# EAGLE design clock2_v1 (EAGLE 9.6.2)
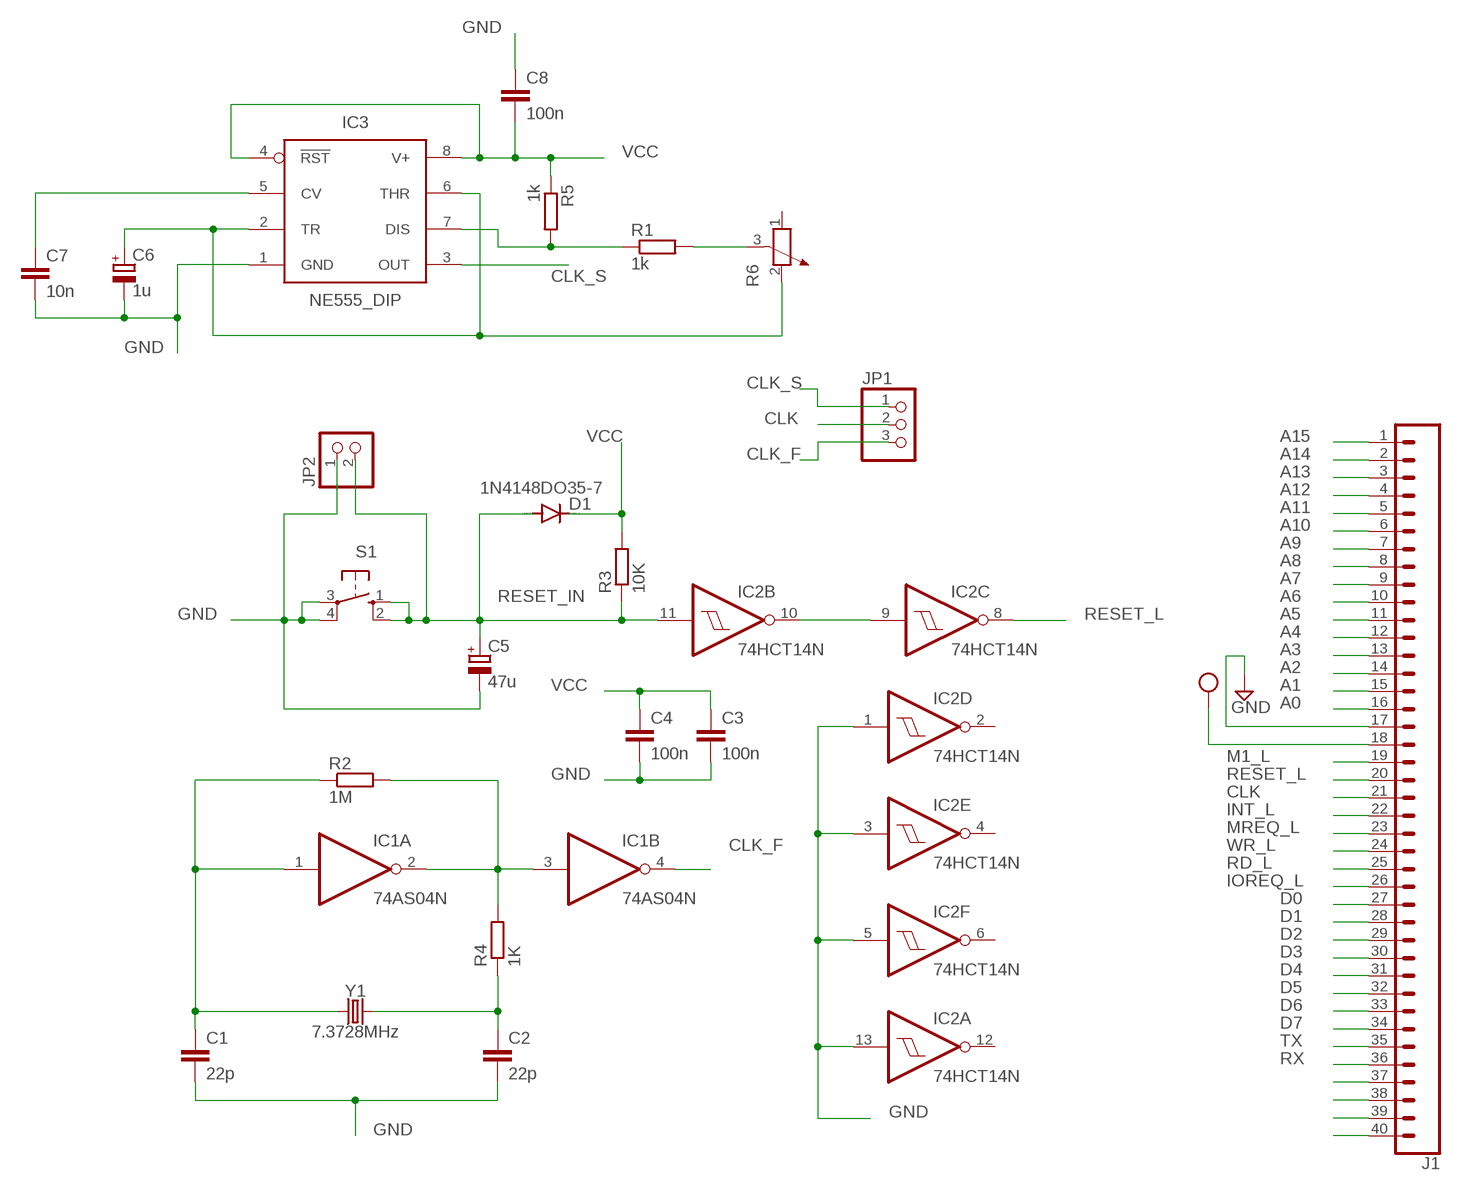
[diagram p0: schematic, sheet 1]

## Parts
C1  22p  C-EU025-024X044  [C025-024X044]
C2  22p  C-EU025-024X044  [C025-024X044]
C3  100n  C-EU025-024X044  [C025-024X044]
C4  100n  C-EU025-024X044  [C025-024X044]
C5  47u  CPOL-EUE2.5-5  [E2,5-5]
C6  1u  CPOL-EUE2.5-5  [E2,5-5]
C7  10n  C-EU050-025X075  [C050-025X075]
C8  100n  C-EU050-025X075  [C050-025X075]
D1  1N4148DO35-7  [DO35-7]
IC1  74AS04N  [DIL14]
IC2  74HCT14N  [DIL14]
IC3  NE555_DIP  [DIP826W53P254L959H508Q8B]
J1  CONN_40OFFSET  [1X40_OFFSET]
JP1  PINHD-1X3  [1X03]
JP2  PINHD-1X2  [1X02]
R1  1k  R-EU_0207/7  [0207/7]
R2  1M  R-EU_0204/5  [0204/5]
R3  10K  R-EU_0207/7  [0207/7]
R4  1K  R-EU_0204/5  [0204/5]
R5  1k  R-EU_0207/7  [0207/7]
R6  POTENTIOMETER_PT-10S  [PT-10S]
S1  10-XX  [B3F-10XX]
Y1  7.3728MHz  CRYSTALPTH-HC49UV  [HC49U]

## Nets
A0: J1.16
A1: J1.15
A2: J1.14
A3: J1.13
A4: J1.12
A5: J1.11
A6: J1.10
A7: J1.9
A8: J1.8
A9: J1.7
A10: J1.6
A11: J1.5
A12: J1.4
A13: J1.3
A14: J1.2
A15: J1.1
CLK: J1.21 JP1.2
CLK_F: IC1.4(B:O) JP1.3
CLK_S: IC3.3(OUT) JP1.1
D0: J1.27
D1: J1.28
D2: J1.29
D3: J1.30
D4: J1.31
D5: J1.32
D6: J1.33
D7: J1.34
GND: C1.2 C2.2 C3.2 C4.2 C5.- C6.- C7.2 C8.1 IC2.1(D:I) IC2.3(E:I) IC2.5(F:I) IC2.13(A:I) IC3.1(GND) J1.17 JP2.1 S1.3(P) S1.4(P1)
INT_L: J1.22
IOREQ_L: J1.26
M1_L: J1.19
MREQ_L: J1.23
N$1: C1.1 IC1.1(A:I) R2.1 Y1.1
N$2: C2.1 R4.1 Y1.2
N$3: C7.1 IC3.5(CV)
N$4: IC1.2(A:O) IC1.3(B:I) R2.2 R4.2
N$5: IC2.9(C:I) IC2.10(B:O)
N$6: J1.37
N$7: J1.38
N$8: J1.39
N$9: C6.+ IC3.2(TR) IC3.6(THR) R6.2
N$10: IC3.7(DIS) R1.1 R5.2
N$12: R1.2 R6.3
N$13: J1.40
RD_L: J1.25
RESET_IN: C5.+ D1.A IC2.11(B:I) JP2.2 R3.1 S1.1(S) S1.2(S1)
RESET_L: IC2.8(C:O) J1.20
RX: J1.36
TX: J1.35
VCC: C3.1 C4.1 C8.2 D1.C IC3.4(!RST) IC3.8(V+) J1.18 R3.2 R5.1
WR_L: J1.24
Unconnected: IC1.5(C:I) IC1.6(C:O) IC1.8(D:O) IC1.9(D:I) IC1.10(E:O) IC1.11(E:I) IC1.12(F:O) IC1.13(F:I) IC2.2(D:O) IC2.4(E:O) IC2.6(F:O) IC2.12(A:O) R6.1

## Power pins joined to a net without a drawn wire
GND: IC1.7(P:GND) IC2.7(P:GND)
VCC: IC1.14(P:VCC) IC2.14(P:VCC)

## Library data of the parts
C1-C4 C7 C8 = rcl:C-EU: CAPACITOR, European symbol; SPICEPREFIX: C
C5 C6 = rcl:CPOL-EU: POLARIZED CAPACITOR, European symbol; SPICEPREFIX: C
D1 = diode:1N4148: DIODE high speed (Philips)
IC1 = 74xx-eu:74*04: Hex INVERTER
IC2 = 74xx-eu:74*14: Hex schmitt trigger INVERTER
IC3 = IC_Clock-Timing:*555: TIMER 555 General purpose precision timers NE555 : Texas Datasheet <http://www.ti.com/general/docs/suppproductinfo.tsp?distId=10&gotoUrl=http%3A%2F%2Fwww.ti.com%2Flit%2Fgpn%2Fne555>, Diodes Incorporated Datasheet <https://www.diodes.com/assets/Datasheets/NE555_SA555_NA555.pdf> LM555 Datasheet <http://www.ti.com/general/docs/suppproductinfo.tsp?distId=10&gotoUrl=http%3A%2F%2Fwww.ti.com%2Flit%2Fgpn%2Flm555> LMC555 Datasheet <http://www.ti.com/general/docs/suppproductinfo.tsp?distId=10&gotoUrl=http%3A%2F%2Fwww.ti.com%2Flit%2Fgpn%2Flmc555> ICM7555 : Maxim Integrated Datasheet <https://datasheets.maximintegrated.com/en/ds/ICM7555-ICM7556.pdf>, Renesas Electronics America Inc Datasheet <https://www.renesas.com/en-us/www/doc/datasheet/icm7555-56.pdf>; CATEGORY: IC_Clock-Timing; CURRENT-SUPPLY: 10mA; DESCRIPTION: IC OSC SINGLE TIMER 100KHZ 8-DIP; FREQUENCY: 100kHz; MANUFACTURER: Texas Instruments; MPN: NE555P; OPERATING_TEMP: 0°C to 70°C; PART_STATUS: Active; ROHS_COMPLIANT: ROHS3 Compliant; SUB-CATEGORY: Timer
J1 = SparkFun-Connectors:CONN_40: Multi connection point. Often used as Generic Header-pin footprint for 0.1 inch spaced/style header connections On any of the 0.1 inch spaced packages, you can populate with these: Break Away Headers - Straight <https://www.sparkfun.com/products/116> (PRT-00116) Break Away Male Headers - Right Angle <https://www.sparkfun.com/products/553> (PRT-00553) Female Headers <https://www.sparkfun.com/products/115> (PRT-00115) Break Away Headers - Machine Pin <https://www.sparkfun.com/products/117> (PRT-00117) Break Away Female Headers - Swiss Machine Pin <https://www.sparkfun.com/products/743> (PRT-00743) For SCREWTERMINALS and SPRING TERMINALS visit here: Screw Terimnals on SparkFun.com <https://www.sparkfun.com/search/results?term=Screw+Terminals> (5mm/3.5mm/2.54mm spacing) This device is also useful as a general connection point to wire up your design to another part of your project. Our various solder wires solder well into these plated through hole pads. Hook-Up Wire - Assortment (Stranded, 22 AWG) <https://www.sparkfun.com/products/11375> (PRT-11375) Hook-Up Wire - Assortment (Solid Core, 22 AWG) <https://www.sparkfun.com/products/11367> (PRT-11367) View the entire wire category on our website here <https://www.sparkfun.com/categories/141> Special notes: Molex polarized connector foot print use with SKU : PRT-08231 with associated crimp pins and housings. 1MM SMD Version SKU: PRT-10208 NOTES ON THE VARIANTS LOCK and LOCK_LONGPADS... This footprint was designed to help hold the alignment of a through-hole component (i.e. 6-pin header) while soldering it into place. You may notice that each hole has been shifted either up or down by 0.005 of an inch from it's more standard position (which is a perfectly straight line). This slight alteration caused the pins (the squares in the middle) to touch the edges of the holes. Because they are alternating, it causes a "brace" to hold the component in place. 0.005 has proven to be the perfect amount of "off-center" position when using our standard breakaway headers. Although looks a little odd when you look at the bare footprint, once you have a header in there, the alteration is very hard to notice. Also,if you push a header all the way into place, it is covered up entirely on the bottom side.
JP1 = pinhead:PINHD-1X3: PIN HEADER
JP2 = pinhead:PINHD-1X2: PIN HEADER
R1-R5 = rcl:R-EU_: RESISTOR, European symbol; SPICEPREFIX: R
R6 = rcl:POTENTIOMETER_: Potentiometer; SPICEMODEL: POT; SPICEPREFIX: X
S1 = switch-omron:10-XX: OMRON SWITCH; MPN: B3F-1000; OC_FARNELL: 176432; OC_NEWARK: 36M3542
Y1 = SparkFun-Clocks:CRYSTAL: Crystals (Generic) These are passive quartz crystals, which can be used as a clock source for a microcontroller. Crystal's are two-terminal devices. They require external "load" capacitors to generate an oscillating signal.

## Board
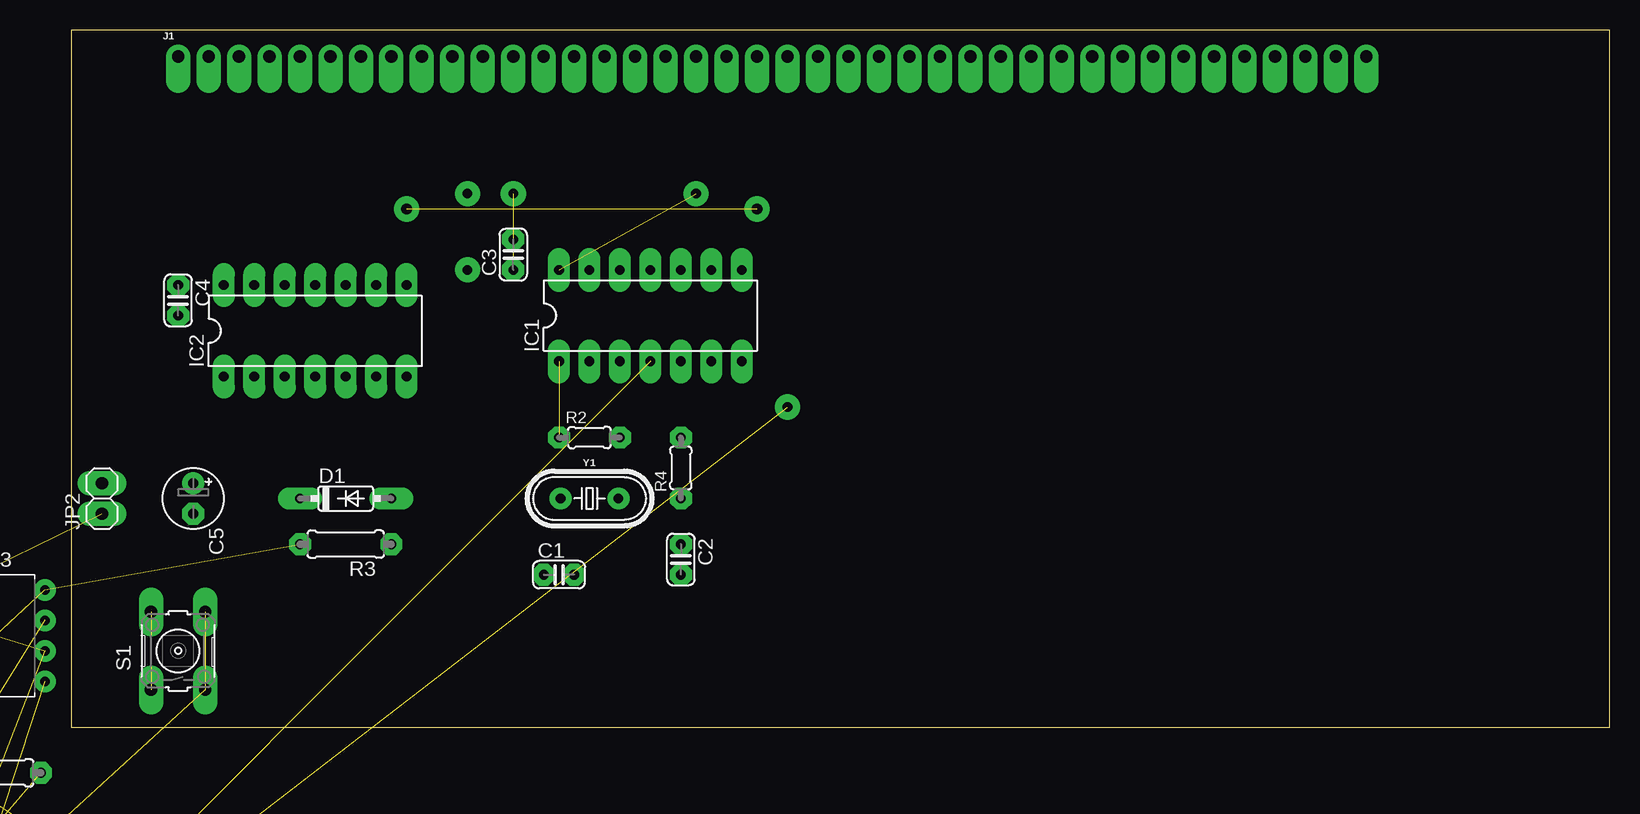
[diagram p1: board, top side]
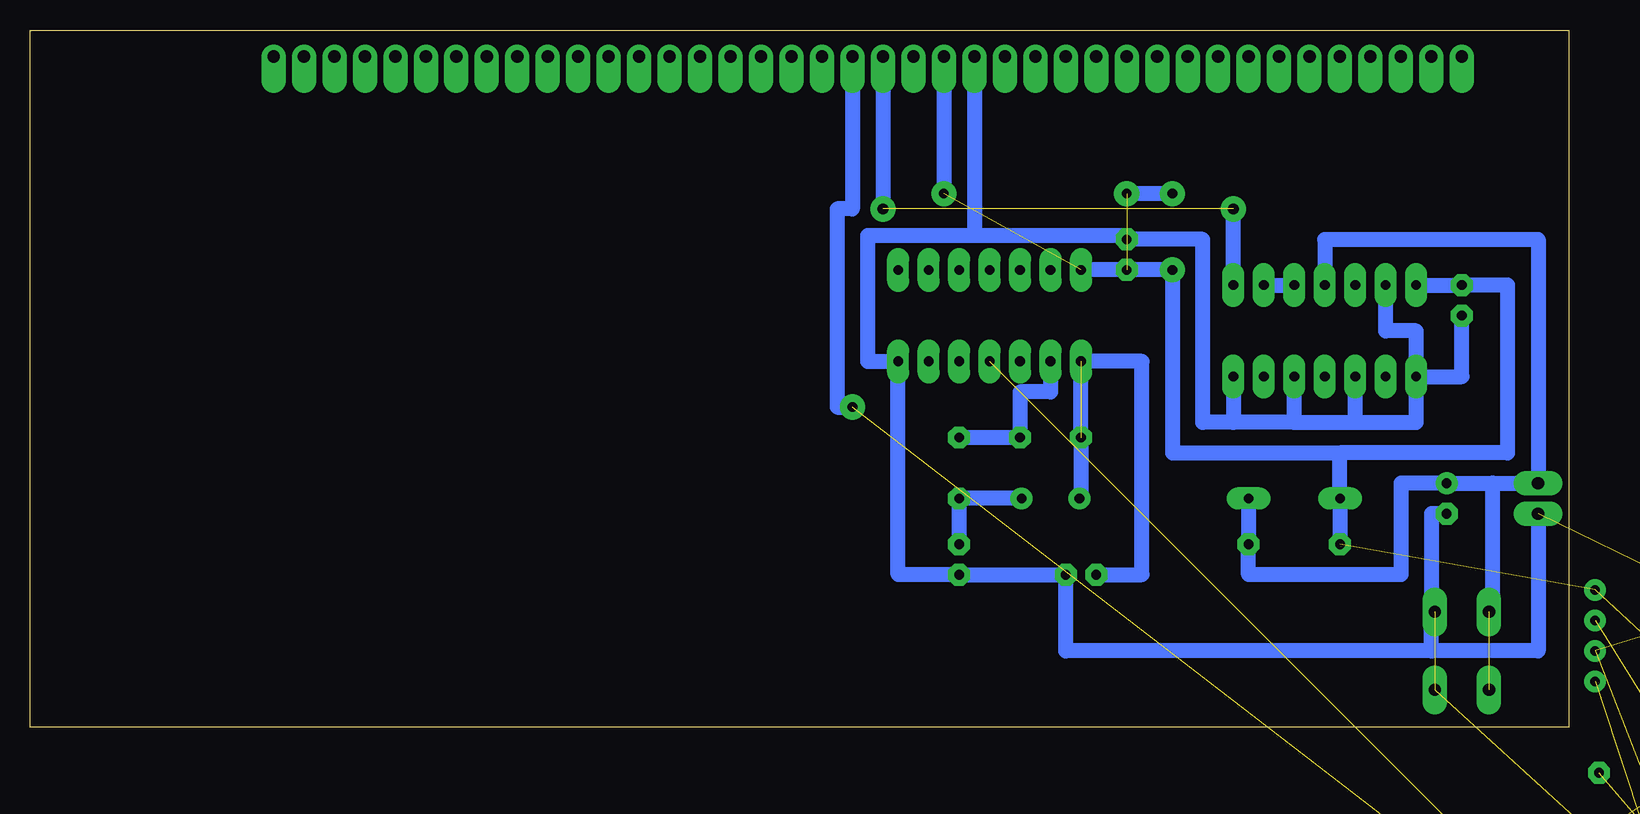
[diagram p2: board, bottom side, seen from below]

Size 128.25 x 58.09 mm. Coordinates in mm from the lower left corner, seen from the top.
Outline: 0,0 128.25,0 128.25,58.09 0,58.09 0,0
Copper layers (1*16): Top 0.035mm / dielectric 1.5mm / Bottom 0.035mm
Design rules "LabE": minimum track width 50mil, minimum drill 0.8mm, track to track 16mil, track to pad 16mil, pad to pad 16mil, via to via 16mil, smd to smd 16mil, copper to edge 0mil, drill to drill 16mil, minimum pad ring 20mil, minimum via ring 20mil, stop-mask expansion 4mil, vias tented up to drill 0mil, thermal gap 10mil

### Footprints (pad centres in the part's own frame; a part is rotated, then mirrored left to right if it is on the bottom)
C025-024X044 = drill 0.813 octagon: 1 -1.27,0; 2 1.27,0
E2,5-5 = drill 0.813 pad 1.6: + -1.27,0 | drill 0.813 pad 1.6 octagon: - 1.27,0
C050-025X075 = drill 0.813 octagon: 1 -2.54,0; 2 2.54,0
DO35-7 = drill 0.813 long: A 3.81,0; C -3.81,0
DIL14 = drill 0.813 long: 1 -7.62,-3.81; 2 -5.08,-3.81; 3 -2.54,-3.81; 4 0,-3.81; 5 2.54,-3.81; 6 5.08,-3.81; 7 7.62,-3.81; 8 7.62,3.81; 9 5.08,3.81; 10 2.54,3.81; 11 0,3.81; 12 -2.54,3.81; 13 -5.08,3.81; 14 -7.62,3.81
DIP826W53P254L959H508Q8B = drill 0.786 pad 1.386: 1 -4.13,3.81; 2 -4.13,1.27; 3 -4.13,-1.27; 4 -4.13,-3.81; 5 4.13,-3.81; 6 4.13,-1.27; 7 4.13,1.27; 8 4.13,3.81
1X40_OFFSET = drill 1.016 pad 1.88 offset: 1 0,0; 2 2.54,0; 3 5.08,0; 4 7.62,0; 5 10.16,0; 6 12.7,0; 7 15.24,0; 8 17.78,0; 9 20.32,0; 10 22.86,0; 11 25.4,0; 12 27.94,0; 13 30.48,0; 14 33.02,0; 15 35.56,0; 16 38.1,0; 17 40.64,0; 18 43.18,0; 19 45.72,0; 20 48.26,0; 21 50.8,0; 22 53.34,0; 23 55.88,0; 24 58.42,0; 25 60.96,0; 26 63.5,0; 27 66.04,0; 28 68.58,0; 29 71.12,0; 30 73.66,0; 31 76.2,0; 32 78.74,0; 33 81.28,0; 34 83.82,0; 35 86.36,0; 36 88.9,0; 37 91.44,0; 38 93.98,0; 39 96.52,0; 40 99.06,0
1X03 = drill 1.016 long: 1 -2.54,0; 2 0,0; 3 2.54,0
1X02 = drill 1.016 long: 1 -1.27,0; 2 1.27,0
0207/7 = drill 0.813 octagon: 1 -3.81,0; 2 3.81,0
0204/5 = drill 0.813 octagon: 1 -2.54,0; 2 2.54,0
PT-10S = drill 1.016 pad 1.778 octagon: 1 -2.54,-1.27; 2 2.54,-1.27; 3 0,1.27
B3F-10XX = drill 1.016 long: 1 -3.251,2.261; 2 3.251,2.261; 3 -3.251,-2.261; 4 3.251,-2.261
HC49U = drill 0.813: 1 -2.413,0; 2 2.413,0

### Placement (x,y rotation side)
C1  40.64,12.7 0 top
C2  50.8,13.97 270 top
C3  36.83,39.37 90 top
C4  8.89,35.56 270 top
C5  10.16,19.05 270 top
C6  -8.89,-13.97 0 top  (outside the outline)
C7  -7.62,-20.32 0 top  (outside the outline)
C8  -7.62,-25.4 0 top  (outside the outline)
D1  22.86,19.05 0 top
IC1  48.26,34.29 0 top
IC2  20.32,33.02 0 top
IC3  -6.35,7.62 0 top
J1  8.89,55.88 0 top
JP1  -17.78,-33.02 0 top  (outside the outline)
JP2  2.54,19.05 90 top
R1  -6.35,-3.81 0 top  (outside the outline)
R2  43.18,24.13 0 top
R3  22.86,15.24 180 top
R4  50.8,21.59 90 top
R5  -6.35,-8.89 0 top  (outside the outline)
R6  -17.78,-22.86 0 top  (outside the outline)
S1  8.89,6.35 90 top
Y1  43.18,19.05 0 top

### Tracks (layer width: path | path; a pad name or v marks a point on that pad's centre or on a via)
CLK  (via drill 0.8 pad 2.1)  (1 unrouted)
  Bottom 1.27: J1.21 59.69,43.18 60.96,43.18 60.96,26.67 v59.69,26.67
CLK_F  (1 unrouted)
CLK_S  (1 unrouted)
GND  (5 unrouted)
  Bottom 1.27: 49.53,40.97 58.42,40.97 58.42,30.48 IC1.7 55.88,12.7 C2.2 C1.2 41.91,6.35 11.43,6.35 | 49.53,40.97 37.16,40.97 C3.2 30.48,40.64 30.48,25.4 27.94,25.4 | IC2.1 12.7,33.02 15.24,33.02 IC2.13 | IC2.7 27.94,25.4 | 22.86,25.4 27.94,25.4 | 22.86,25.4 IC2.5 | 22.86,25.4 17.78,25.4 | 17.78,25.4 IC2.3 | 17.78,25.4 12.7,25.4 IC2.1 | IC2.1 8.89,29.21 C4.2 | JP2.1 2.54,6.35 11.43,6.35 | 11.43,6.35 11.43,9.32 | 11.43,9.32 S1.4 | C5.- 11.43,17.78 11.43,9.32 | J1.17 49.53,40.97
N$1  (4 unrouted)
  Bottom 1.27: C1.1 35.56,12.7 35.56,30.48 IC1.1 R2.1 40.64,19.18 Y1.1
N$2
  Bottom 1.27: Y1.2 R4.1 C2.1
N$3  (1 unrouted)
N$4
  Bottom 1.27: IC1.2 43.18,27.94 45.72,27.94 R2.2 R4.2
N$5
  Bottom 1.27: IC2.9 IC2.10
N$9  (3 unrouted)
N$10  (2 unrouted)
N$12  (1 unrouted)
RESET_IN  (1 unrouted)
  Bottom 1.27: D1.A R3.1 26.67,12.7 13.97,12.7 13.97,20.32 C5.+ 6.35,20.32 | 20.32,38.1 IC2.11 20.32,40.64 2.54,40.64 JP2.2 6.35,20.32 | S1.2 6.35,9.88 6.35,20.32
RESET_L  (via drill 0.9 pad 2.1)  (1 unrouted)
  Bottom 1.27: 27.94,38.1 IC2.8 v27.94,43.18 | J1.20 v57.15,43.18
VCC  (via drill 0.8 pad 2.1)  (6 unrouted)
  Bottom 1.27: IC2.14 C4.1 5.08,36.83 5.08,22.86 19.05,22.86 | R3.2 D1.C 19.05,22.86 | v33.02,44.45 v36.83,44.45 | J1.18 v52.07,44.45 | 19.05,22.86 33.02,22.86 v33.02,38.1 C3.1 IC1.14